# Altium schematic sheet BoardConnector.SchDoc: =TITLE
size A3; DocumentNumber: 2; SheetNumber: 2; SheetTotal: 11
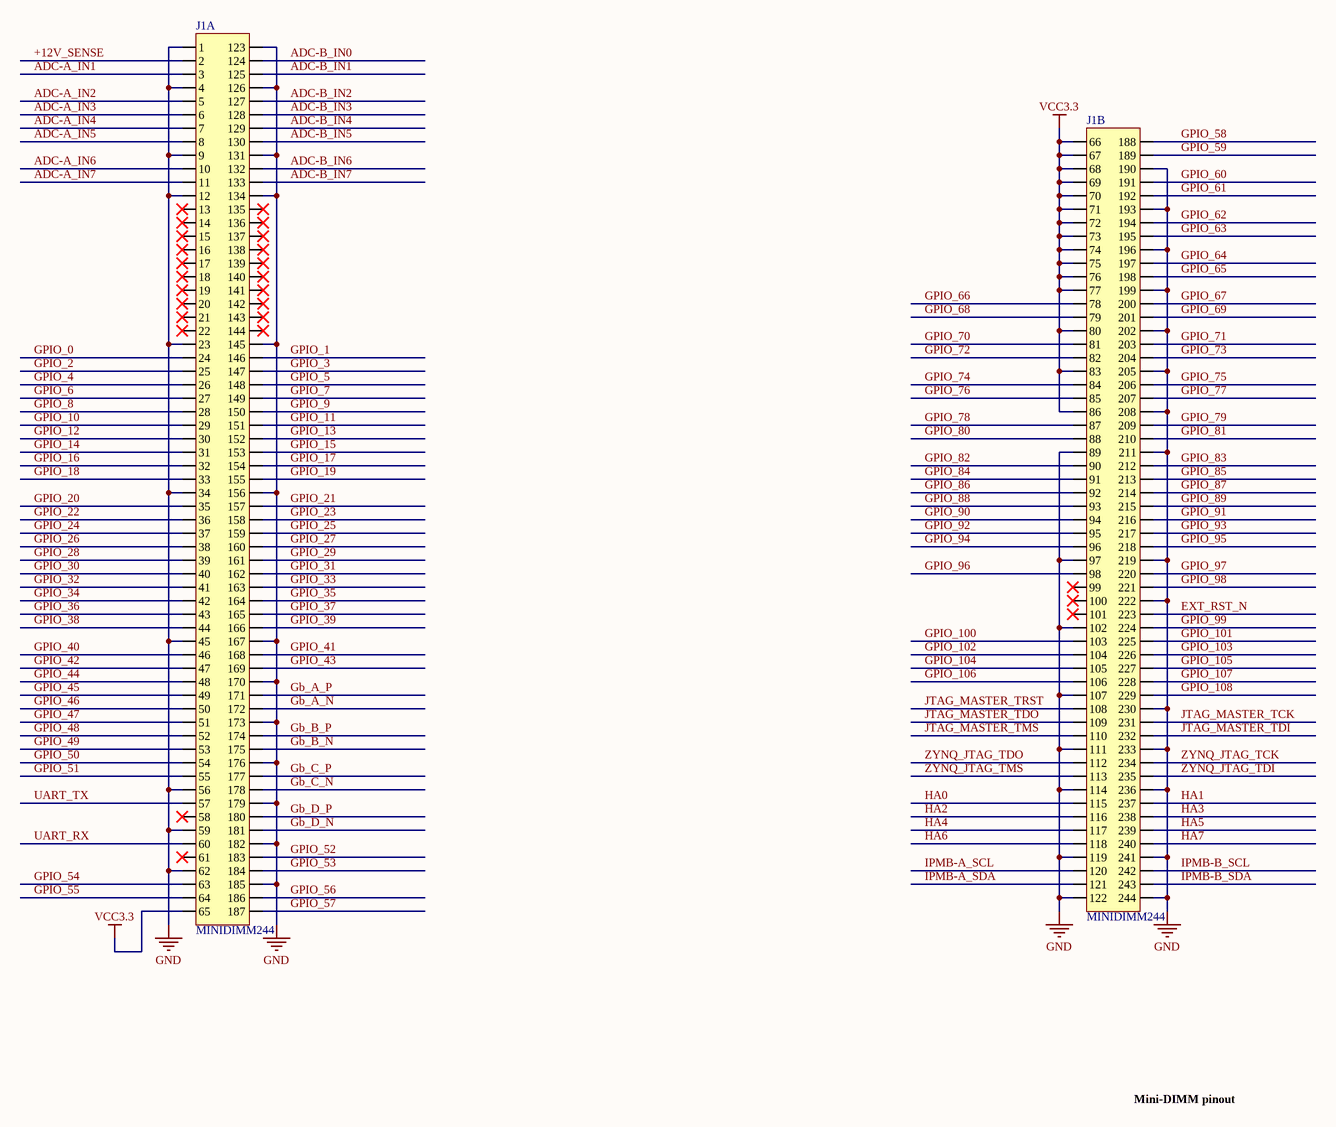
[diagram p0: BoardConnector.SchDoc]

## Parts
J1  MINIDIMM244  [miniDIMM244]  (parts A,B of 2)

## Nets
GND: J1.1 J1.4 J1.9 J1.12 J1.23 J1.34 J1.45 J1.56 J1.59 J1.62 J1.89 J1.97 J1.102 J1.107 J1.111 J1.114 J1.119 J1.122 J1.123 J1.126 J1.131 J1.134 J1.145 J1.156 J1.167 J1.170 J1.173 J1.176 J1.179 J1.182 J1.185 J1.190 J1.193 J1.196 J1.199 J1.202 J1.205 J1.208 J1.211 J1.219 J1.222 J1.230 J1.233 J1.236 J1.241 J1.244
VCC3.3: J1.65 J1.66 J1.67 J1.68 J1.69 J1.70 J1.71 J1.72 J1.73 J1.74 J1.75 J1.76 J1.77 J1.80 J1.83 J1.86
+12V_SENSE: J1.2
ADC-A_IN1: J1.3
ADC-A_IN2: J1.5
ADC-A_IN3: J1.6
ADC-A_IN4: J1.7
ADC-A_IN5: J1.8
ADC-A_IN6: J1.10
ADC-A_IN7: J1.11
ADC-B_IN0: J1.124
ADC-B_IN1: J1.125
ADC-B_IN2: J1.127
ADC-B_IN3: J1.128
ADC-B_IN4: J1.129
ADC-B_IN5: J1.130
ADC-B_IN6: J1.132
ADC-B_IN7: J1.133
EXT_RST_N: J1.223
Gb_A_N: J1.172
Gb_A_P: J1.171
Gb_B_N: J1.175
Gb_B_P: J1.174
Gb_C_N: J1.178
Gb_C_P: J1.177
Gb_D_N: J1.181
Gb_D_P: J1.180
GPIO_0: J1.24
GPIO_1: J1.146
GPIO_2: J1.25
GPIO_3: J1.147
GPIO_4: J1.26
GPIO_5: J1.148
GPIO_6: J1.27
GPIO_7: J1.149
GPIO_8: J1.28
GPIO_9: J1.150
GPIO_10: J1.29
GPIO_11: J1.151
GPIO_12: J1.30
GPIO_13: J1.152
GPIO_14: J1.31
GPIO_15: J1.153
GPIO_16: J1.32
GPIO_17: J1.154
GPIO_18: J1.33
GPIO_19: J1.155
GPIO_20: J1.35
GPIO_21: J1.157
GPIO_22: J1.36
GPIO_23: J1.158
GPIO_24: J1.37
GPIO_25: J1.159
GPIO_26: J1.38
GPIO_27: J1.160
GPIO_28: J1.39
GPIO_29: J1.161
GPIO_30: J1.40
GPIO_31: J1.162
GPIO_32: J1.41
GPIO_33: J1.163
GPIO_34: J1.42
GPIO_35: J1.164
GPIO_36: J1.43
GPIO_37: J1.165
GPIO_38: J1.44
GPIO_39: J1.166
GPIO_40: J1.46
GPIO_41: J1.168
GPIO_42: J1.47
GPIO_43: J1.169
GPIO_44: J1.48
GPIO_45: J1.49
GPIO_46: J1.50
GPIO_47: J1.51
GPIO_48: J1.52
GPIO_49: J1.53
GPIO_50: J1.54
GPIO_51: J1.55
GPIO_52: J1.183
GPIO_53: J1.184
GPIO_54: J1.63
GPIO_55: J1.64
GPIO_56: J1.186
GPIO_57: J1.187
GPIO_58: J1.188
GPIO_59: J1.189
GPIO_60: J1.191
GPIO_61: J1.192
GPIO_62: J1.194
GPIO_63: J1.195
GPIO_64: J1.197
GPIO_65: J1.198
GPIO_66: J1.78
GPIO_67: J1.200
GPIO_68: J1.79
GPIO_69: J1.201
GPIO_70: J1.81
GPIO_71: J1.203
GPIO_72: J1.82
GPIO_73: J1.204
GPIO_74: J1.84
GPIO_75: J1.206
GPIO_76: J1.85
GPIO_77: J1.207
GPIO_78: J1.87
GPIO_79: J1.209
GPIO_80: J1.88
GPIO_81: J1.210
GPIO_82: J1.90
GPIO_83: J1.212
GPIO_84: J1.91
GPIO_85: J1.213
GPIO_86: J1.92
GPIO_87: J1.214
GPIO_88: J1.93
GPIO_89: J1.215
GPIO_90: J1.94
GPIO_91: J1.216
GPIO_92: J1.95
GPIO_93: J1.217
GPIO_94: J1.96
GPIO_95: J1.218
GPIO_96: J1.98
GPIO_97: J1.220
GPIO_98: J1.221
GPIO_99: J1.224
GPIO_100: J1.103
GPIO_101: J1.225
GPIO_102: J1.104
GPIO_103: J1.226
GPIO_104: J1.105
GPIO_105: J1.227
GPIO_106: J1.106
GPIO_107: J1.228
GPIO_108: J1.229
HA0: J1.115
HA1: J1.237
HA2: J1.116
HA3: J1.238
HA4: J1.117
HA5: J1.239
HA6: J1.118
HA7: J1.240
IPMB-A_SCL: J1.120
IPMB-A_SDA: J1.121
IPMB-B_SCL: J1.242
IPMB-B_SDA: J1.243
JTAG_MASTER_TCK: J1.231
JTAG_MASTER_TDI: J1.232
JTAG_MASTER_TDO: J1.109
JTAG_MASTER_TMS: J1.110
JTAG_MASTER_TRST: J1.108
UART_RX: J1.60
UART_TX: J1.57
ZYNQ_JTAG_TCK: J1.234
ZYNQ_JTAG_TDI: J1.235
ZYNQ_JTAG_TDO: J1.112
ZYNQ_JTAG_TMS: J1.113

Not connected (* = marked no-connect by the designer): J1 13* 14* 15* 16* 17* 18* 19* 20* 21* 22* 58* 61* 99* 100* 101* 135* 136* 137* 138* 139* 140* 141* 142* 143* 144*

## Notes on the sheet
- Mini-DIMM pinout
- Description
- Title
- Size:
- Date:
- A3
- Number:
- Time:
- Revision:
- Sheet
- of
- File:
- Author:

## Library data of the parts
J1 = MINIDIMM244: 244-pin miniDIMM pads; Note: NOT A PART